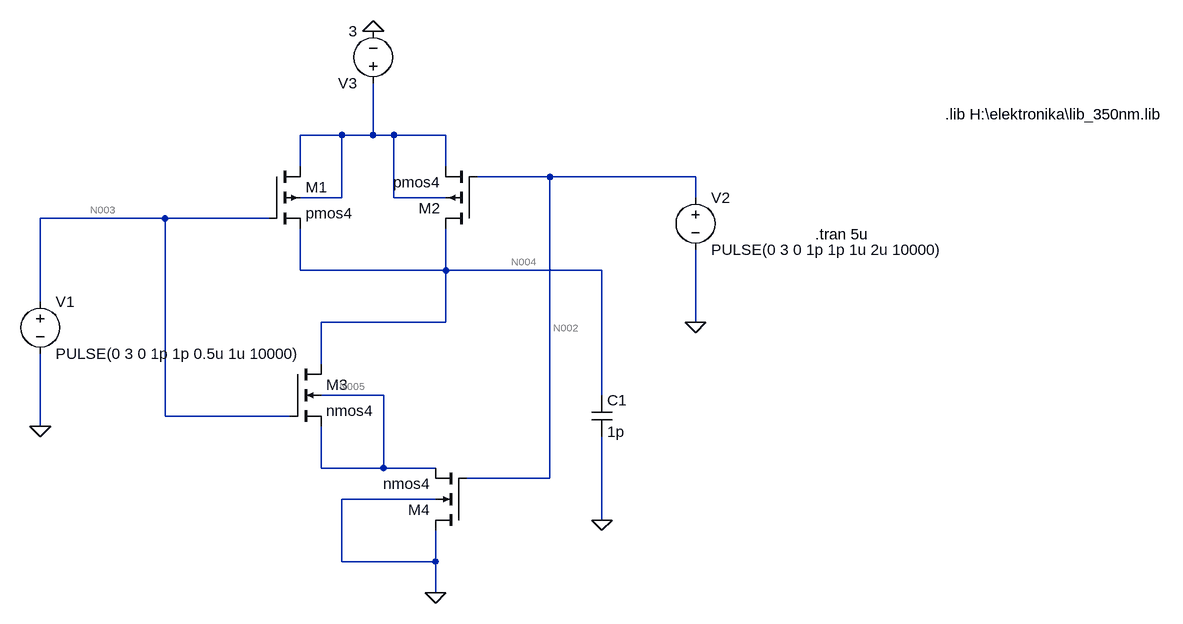
[diagram p0: schematic nand.asc]
nand.asc, the LTspice schematic file:
Version 4
SHEET 1 1032 680
WIRE -304 -224 -368 -224
WIRE -256 -224 -256 -304
WIRE -256 -224 -304 -224
WIRE -224 -224 -256 -224
WIRE -144 -224 -224 -224
WIRE -368 -176 -368 -224
WIRE -144 -176 -144 -224
WIRE 16 -160 -96 -160
WIRE 240 -160 16 -160
WIRE -304 -128 -304 -224
WIRE -304 -128 -368 -128
WIRE -224 -128 -224 -224
WIRE -144 -128 -224 -128
WIRE 240 -128 240 -160
WIRE -576 -96 -768 -96
WIRE -416 -96 -576 -96
WIRE -368 -16 -368 -80
WIRE -144 -16 -144 -80
WIRE -144 -16 -368 -16
WIRE 96 -16 -144 -16
WIRE -768 32 -768 -96
WIRE -144 64 -144 -16
WIRE -144 64 -336 64
WIRE 240 64 240 -48
WIRE -336 128 -336 64
WIRE -240 176 -336 176
WIRE 96 176 96 -16
WIRE -576 208 -576 -96
WIRE -384 208 -576 208
WIRE -768 224 -768 112
WIRE -336 288 -336 224
WIRE -240 288 -240 176
WIRE -240 288 -336 288
WIRE -160 288 -240 288
WIRE 16 304 16 -160
WIRE 16 304 -112 304
WIRE -160 336 -304 336
WIRE 96 368 96 240
WIRE -304 432 -304 336
WIRE -160 432 -160 384
WIRE -160 432 -304 432
WIRE -160 480 -160 432
FLAG 96 368 0
FLAG -160 480 0
FLAG 240 64 0
FLAG -768 224 0
FLAG -256 -384 0
SYMBOL pmos4 -416 -176 R0
SYMATTR InstName M1
SYMATTR Value pmos4
SYMATTR Value2 l=0.5u w=75u
SYMBOL pmos4 -96 -80 R180
SYMATTR InstName M2
SYMATTR Value pmos4
SYMATTR Value2 l=0.5u w=75u
SYMBOL nmos4 -384 128 R0
SYMATTR InstName M3
SYMATTR Value nmos4
SYMATTR Value2 l=0.5u w=50u
SYMBOL nmos4 -112 384 R180
SYMATTR InstName M4
SYMATTR Value nmos4
SYMATTR Value2 l=0.5u w=50u
SYMBOL cap 80 176 R0
SYMATTR InstName C1
SYMATTR Value 1p
SYMBOL voltage -768 16 R0
WINDOW 123 0 0 Left 2
WINDOW 39 0 0 Left 2
SYMATTR InstName V1
SYMATTR Value PULSE(0 3 0 1p 1p 0.5u 1u 10000)
SYMBOL voltage 240 -144 R0
WINDOW 123 0 0 Left 2
WINDOW 39 0 0 Left 2
SYMATTR InstName V2
SYMATTR Value PULSE(0 3 0 1p 1p 1u 2u 10000)
SYMBOL voltage -256 -288 R180
WINDOW 123 0 0 Left 2
WINDOW 39 0 0 Left 2
SYMATTR InstName V3
SYMATTR Value 3
TEXT 424 -72 Left 2 !.tran 5u
TEXT 624 -256 Left 2 !.lib H:\\elektronika\\lib_350nm.lib

The netlist it stands for:
* nand.asc
M1 N001 N003 N004 N001 pmos4 l=0.5u w=75u
M2 N004 N002 N001 N001 pmos4 l=0.5u w=75u
M3 N004 N003 N005 N005 nmos4 l=0.5u w=50u
M4 0 N002 N005 0 nmos4 l=0.5u w=50u
C1 N004 0 1p
V1 N003 0 PULSE(0 3 0 1p 1p 0.5u 1u 10000)
V2 N002 0 PULSE(0 3 0 1p 1p 1u 2u 10000)
V3 N001 0 3
.model NMOS NMOS
.model PMOS PMOS
.lib standard.mos
.tran 5u
.lib H:\elektronika\lib_350nm.lib
.backanno
.end

* Results of the author's LTspice run, read from the files saved beside the schematic
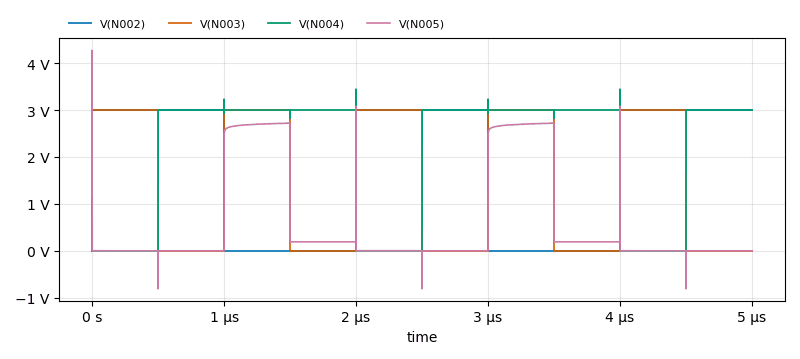
[diagram p1: Transient Analysis of nand.asc, plotted from the saved traces]
* Transient Analysis, 1 run:
*   V(N002): min 0 V, max 3 V, average 1.8 V, rms 2.324 V, last 3 V
*   V(N003): min 0 V, max 3 V, average 1.5 V, rms 2.121 V, last 0 V
*   V(N004): min -178.5 mV, max 3.462 V, average 2.1 V, rms 2.51 V, last 3 V
*   V(N005): min -809.8 mV, max 4.271 V, average 575.3 mV, rms 1.204 V, last 0 V